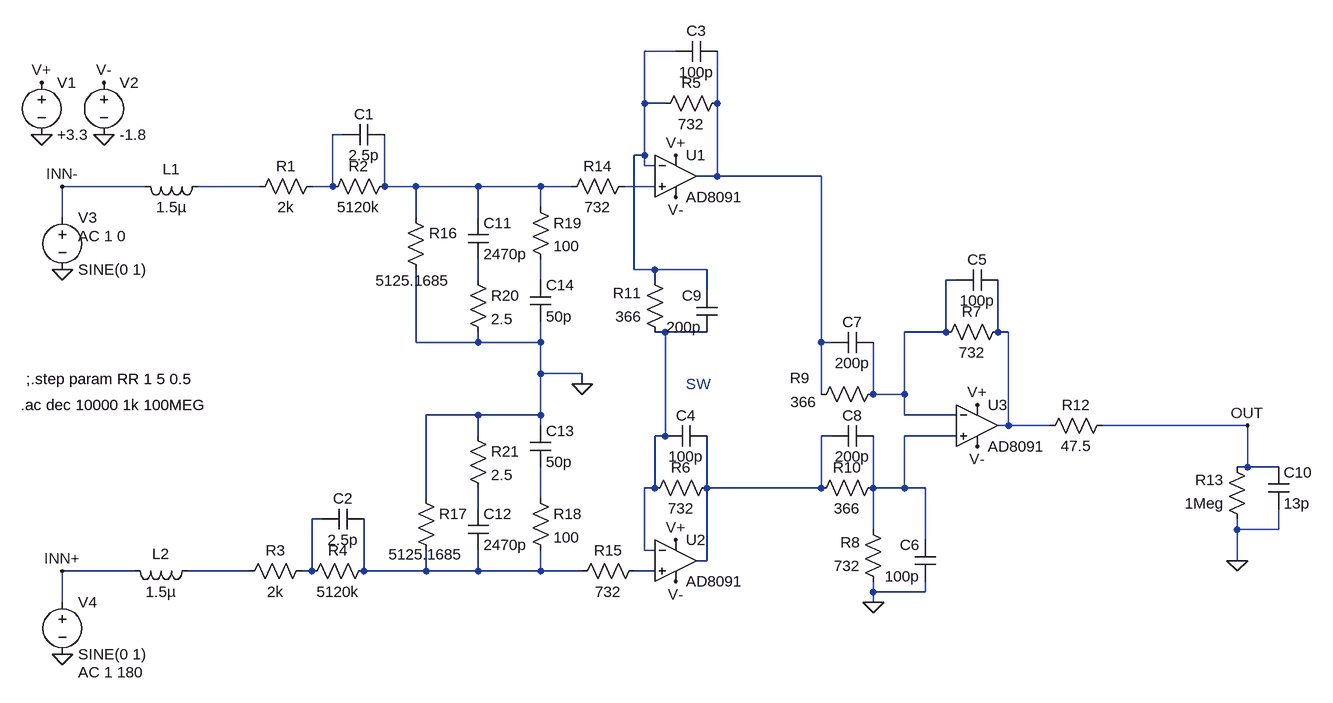
[diagram p0: schematic DraftHVDP8091.asc]
DraftHVDP8091.asc, the LTspice schematic file:
Version 4
SHEET 1 1000 680
WIRE 16 -336 -32 -336
WIRE -32 -256 -32 -336
WIRE 0 -256 -32 -256
WIRE 80 -256 80 -336
WIRE -496 -208 -512 -208
WIRE -32 -176 -32 -256
WIRE -32 -176 -48 -176
WIRE -32 -160 -32 -176
WIRE -16 -160 -32 -160
WIRE 80 -144 80 -256
WIRE 80 -144 48 -144
WIRE 240 -144 80 -144
WIRE -800 -128 -928 -128
WIRE -624 -128 -720 -128
WIRE -512 -128 -512 -208
WIRE -512 -128 -544 -128
WIRE -432 -128 -432 -208
WIRE -384 -128 -432 -128
WIRE -288 -128 -384 -128
WIRE -192 -128 -288 -128
WIRE -144 -128 -192 -128
WIRE -16 -128 -64 -128
WIRE -192 -96 -192 -128
WIRE -928 -80 -928 -128
WIRE -384 -80 -384 -128
WIRE -288 -80 -288 -128
WIRE -48 0 -48 -176
WIRE -16 0 -48 0
WIRE 64 0 -16 0
WIRE -288 16 -288 -16
WIRE -192 16 -192 -16
WIRE -16 16 -16 0
WIRE 448 16 432 16
WIRE 64 32 64 0
WIRE 0 96 -16 96
WIRE 64 96 0 96
WIRE 432 96 432 16
WIRE 432 96 368 96
WIRE 512 96 512 16
WIRE 528 96 512 96
WIRE -384 112 -384 0
WIRE -288 112 -288 96
WIRE -288 112 -384 112
WIRE -192 112 -192 80
WIRE -192 112 -288 112
WIRE 240 112 240 -144
WIRE 256 112 240 112
WIRE -192 160 -192 112
WIRE -128 160 -192 160
WIRE -128 176 -128 160
WIRE 240 192 240 112
WIRE 320 192 320 112
WIRE 368 192 368 96
WIRE 368 192 320 192
WIRE -288 224 -368 224
WIRE -192 224 -192 160
WIRE -192 224 -288 224
WIRE 368 224 368 192
WIRE 448 224 368 224
WIRE -192 240 -192 224
WIRE 528 240 528 96
WIRE 528 240 512 240
WIRE 592 240 528 240
WIRE 896 240 672 240
WIRE -288 256 -288 224
WIRE 0 256 0 96
WIRE 0 256 -16 256
WIRE 256 256 240 256
WIRE 448 256 368 256
WIRE 896 304 896 240
WIRE 896 304 880 304
WIRE 944 304 896 304
WIRE -16 336 -16 256
WIRE -16 336 -32 336
WIRE 64 336 64 256
WIRE 240 336 240 256
WIRE 240 336 64 336
WIRE 320 336 320 256
WIRE 368 336 368 256
WIRE 368 336 320 336
WIRE 400 336 368 336
WIRE -368 352 -368 224
WIRE -192 352 -192 304
WIRE -288 368 -288 336
WIRE -528 384 -544 384
WIRE 320 400 320 336
WIRE 880 400 880 384
WIRE 944 400 944 368
WIRE 944 400 880 400
WIRE 400 416 400 336
WIRE -32 432 -32 336
WIRE -16 432 -32 432
WIRE 64 448 64 336
WIRE 64 448 48 448
WIRE 880 448 880 400
WIRE -816 464 -928 464
WIRE -640 464 -736 464
WIRE -544 464 -544 384
WIRE -544 464 -560 464
WIRE -464 464 -464 384
WIRE -368 464 -368 432
WIRE -368 464 -464 464
WIRE -288 464 -288 432
WIRE -288 464 -368 464
WIRE -192 464 -192 432
WIRE -192 464 -288 464
WIRE -128 464 -192 464
WIRE -16 464 -48 464
WIRE 320 496 320 480
WIRE 400 496 400 480
WIRE 400 496 320 496
WIRE -928 512 -928 464
WIRE 320 512 320 496
FLAG -960 -208 0
FLAG -864 -208 0
FLAG -960 -288 V+
FLAG 16 -176 V+
FLAG 480 208 V+
FLAG 16 416 V+
FLAG -864 -288 V-
FLAG 16 -112 V-
FLAG 16 480 V-
FLAG 480 272 V-
FLAG 320 512 0
FLAG -928 592 0
FLAG -928 0 0
FLAG -928 464 INN+
FLAG -928 -128 INN-
FLAG 880 448 0
FLAG -128 176 0
FLAG 896 240 OUT
SYMBOL OpAmps\\AD8091 16 -208 R0
SYMATTR InstName U1
SYMBOL OpAmps\\AD8091 16 384 R0
SYMATTR InstName U2
SYMBOL OpAmps\\AD8091 480 176 R0
SYMATTR InstName U3
SYMBOL voltage -960 -304 R0
WINDOW 123 0 0 Left 0
WINDOW 39 0 0 Left 0
SYMATTR InstName V1
SYMATTR Value +3.3
SYMBOL voltage -864 -304 R0
WINDOW 123 0 0 Left 0
WINDOW 39 0 0 Left 0
SYMATTR InstName V2
SYMATTR Value -1.8
SYMBOL res -528 -144 R90
WINDOW 0 0 56 VBottom 2
WINDOW 3 32 56 VTop 2
SYMATTR InstName R1
SYMATTR Value 2k
SYMBOL res -416 -144 R90
WINDOW 0 0 56 VBottom 2
WINDOW 3 32 56 VTop 2
SYMATTR InstName R2
SYMATTR Value 5120k
SYMBOL res -544 448 R90
WINDOW 0 0 56 VBottom 2
WINDOW 3 32 56 VTop 2
SYMATTR InstName R3
SYMATTR Value 2k
SYMBOL res -448 448 R90
WINDOW 0 0 56 VBottom 2
WINDOW 3 32 56 VTop 2
SYMATTR InstName R4
SYMATTR Value 5120k
SYMBOL cap -432 -224 R90
WINDOW 0 0 32 VBottom 2
WINDOW 3 32 32 VTop 2
SYMATTR InstName C1
SYMATTR Value 2.5p
SYMBOL cap -464 368 R90
WINDOW 0 0 32 VBottom 2
WINDOW 3 32 32 VTop 2
SYMATTR InstName C2
SYMATTR Value 2.5p
SYMBOL res 96 -272 R90
WINDOW 0 0 56 VBottom 2
WINDOW 3 32 56 VTop 2
SYMATTR InstName R5
SYMATTR Value 732
SYMBOL cap 80 -352 R90
WINDOW 0 0 32 VBottom 2
WINDOW 3 32 32 VTop 2
SYMATTR InstName C3
SYMATTR Value 100p
SYMBOL res 80 320 R90
WINDOW 0 0 56 VBottom 2
WINDOW 3 32 56 VTop 2
SYMATTR InstName R6
SYMATTR Value 732
SYMBOL cap 64 240 R90
WINDOW 0 0 32 VBottom 2
WINDOW 3 32 32 VTop 2
SYMATTR InstName C4
SYMATTR Value 100p
SYMBOL res 528 80 R90
WINDOW 0 0 56 VBottom 2
WINDOW 3 32 56 VTop 2
SYMATTR InstName R7
SYMATTR Value 732
SYMBOL cap 512 0 R90
WINDOW 0 0 32 VBottom 2
WINDOW 3 32 32 VTop 2
SYMATTR InstName C5
SYMATTR Value 100p
SYMBOL res 336 496 R180
WINDOW 0 36 76 Left 2
WINDOW 3 36 40 Left 2
SYMATTR InstName R8
SYMATTR Value 732
SYMBOL cap 416 480 R180
WINDOW 0 24 56 Left 2
WINDOW 3 24 8 Left 2
SYMATTR InstName C6
SYMATTR Value 100p
SYMBOL res 336 176 R90
WINDOW 0 6 129 VBottom 2
WINDOW 3 12 123 VTop 2
SYMATTR InstName R9
SYMATTR Value 366
SYMBOL cap 320 96 R90
WINDOW 0 0 32 VBottom 2
WINDOW 3 32 32 VTop 2
SYMATTR InstName C7
SYMATTR Value 200p
SYMBOL res 336 320 R90
WINDOW 0 0 56 VBottom 2
WINDOW 3 32 56 VTop 2
SYMATTR InstName R10
SYMATTR Value 366
SYMBOL cap 320 240 R90
WINDOW 0 0 32 VBottom 2
WINDOW 3 32 32 VTop 2
SYMATTR InstName C8
SYMATTR Value 200p
SYMBOL res 0 112 R180
WINDOW 0 36 76 Left 2
WINDOW 3 36 40 Left 2
SYMATTR InstName R11
SYMATTR Value 366
SYMBOL cap 80 96 R180
WINDOW 0 24 56 Left 2
WINDOW 3 24 8 Left 2
SYMATTR InstName C9
SYMATTR Value 200p
SYMBOL voltage -928 -96 R0
WINDOW 123 24 44 Left 2
WINDOW 39 0 0 Left 0
SYMATTR Value2 AC 1 0
SYMATTR InstName V3
SYMATTR Value SINE(0 1)
SYMBOL voltage -928 496 R0
WINDOW 123 24 124 Left 2
WINDOW 39 0 0 Left 0
SYMATTR Value2 AC 1 180
SYMATTR InstName V4
SYMATTR Value SINE(0 1)
SYMBOL res 688 224 R90
WINDOW 0 0 56 VBottom 2
WINDOW 3 32 56 VTop 2
SYMATTR InstName R12
SYMATTR Value 47.5
SYMBOL res 896 400 R180
WINDOW 0 36 76 Left 2
WINDOW 3 36 40 Left 2
SYMATTR InstName R13
SYMATTR Value 1Meg
SYMBOL cap 928 304 R0
SYMATTR InstName C10
SYMATTR Value 13p
SYMBOL res -48 -144 R90
WINDOW 0 0 56 VBottom 2
WINDOW 3 32 56 VTop 2
SYMATTR InstName R14
SYMATTR Value 732
SYMBOL res -32 448 R90
WINDOW 0 0 56 VBottom 2
WINDOW 3 32 56 VTop 2
SYMATTR InstName R15
SYMATTR Value 732
SYMBOL res -400 -96 R0
WINDOW 3 -46 113 Left 2
SYMATTR Value 5125.1685
SYMATTR InstName R16
SYMBOL res -384 336 R0
WINDOW 3 -42 102 Left 2
SYMATTR Value 5125.1685
SYMATTR InstName R17
SYMBOL cap -304 -80 R0
SYMATTR InstName C11
SYMATTR Value 2470p
SYMBOL cap -304 368 R0
SYMATTR InstName C12
SYMATTR Value 2470p
SYMBOL res -208 336 R0
SYMATTR InstName R18
SYMATTR Value 100
SYMBOL cap -208 240 R0
SYMATTR InstName C13
SYMATTR Value 50p
SYMBOL cap -208 16 R0
SYMATTR InstName C14
SYMATTR Value 50p
SYMBOL res -208 -112 R0
SYMATTR InstName R19
SYMATTR Value 100
SYMBOL ind -704 -144 R90
WINDOW 0 5 56 VBottom 2
WINDOW 3 32 56 VTop 2
SYMATTR InstName L1
SYMATTR Value 1.5µ
SYMBOL ind -720 448 R90
WINDOW 0 5 56 VBottom 2
WINDOW 3 32 56 VTop 2
SYMATTR InstName L2
SYMATTR Value 1.5µ
SYMBOL res -304 0 R0
SYMATTR InstName R20
SYMATTR Value 2.5
SYMBOL res -304 240 R0
SYMATTR InstName R21
SYMATTR Value 2.5
TEXT -992 208 Left 2 !.ac dec 10000 1k 100MEG
TEXT 32 176 Left 2 ;SW
TEXT -984 168 Left 2 !;.step param RR 1 5 0.5

The netlist it stands for:
* DraftHVDP8091.asc
XU1 N006 N001 V+ V- N002 AD8091  ; pins In+ In- V+ V- OUT
XU2 N019 N010 V+ V- N012 AD8091  ; pins In+ In- V+ V- OUT
XU3 N013 N009 V+ V- N011 AD8091  ; pins In+ In- V+ V- OUT
V1 V+ 0 +3.3
V2 V- 0 -1.8
R1 N003 N004 2k
R2 N005 N003 5120k
R3 N016 N017 2k
R4 N018 N016 5120k
C1 N005 N003 2.5p
C2 N018 N016 2.5p
R5 N002 N001 732
C3 N002 N001 100p
R6 N012 N010 732
C4 N012 N010 100p
R7 N011 N009 732
C5 N011 N009 100p
R8 0 N013 732
C6 0 N013 100p
R9 N009 N002 366
C7 N009 N002 200p
R10 N013 N012 366
C8 N013 N012 200p
R11 N010 N001 366
C9 N010 N001 200p
V3 INN- 0 SINE(0 1) AC 1 0
V4 INN+ 0 SINE(0 1) AC 1 180
R12 OUT N011 47.5
R13 0 OUT 1Meg
C10 OUT 0 13p
R14 N006 N005 732
R15 N019 N018 732
R16 N005 0 5125.1685
R17 0 N018 5125.1685
C11 N005 N007 2470p
C12 N015 N018 2470p
R18 N014 N018 100
C13 0 N014 50p
C14 N008 0 50p
R19 N005 N008 100
L1 N004 INN- 1.5µ
L2 N017 INN+ 1.5µ
R20 N007 0 2.5
R21 0 N015 2.5
.ac dec 10000 1k 100MEG
* SW
;.step param RR 1 5 0.5
.backanno
.end